# Altium schematic sheet 1N4148W_C7271101_1N4148W_C727110.schdoc
size 127 x 101 mm
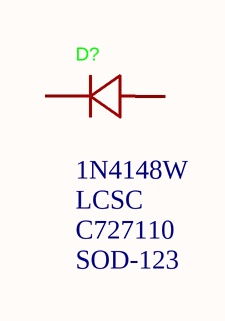
[diagram p0: 1N4148W_C7271101_1N4148W_C727110.schdoc]

## Parts
D?  Supplier Part: C727110  Supplier Footprint: SOD-123  Supplier: LCSC  [SOD-123_L3.1-W1.7-LS3.7-RD]  (hidden comment: 1N4148W)

## Nets

Not connected (* = marked no-connect by the designer): D? 1(K) 2(A)

## Library data of the parts
D? = 1N4148W_C727110: Manufacturer: TWGMC(台湾迪嘉); Current - Rectified: 300mA; Pd - Power Dissipation: 400mW; Reverse Leakage Current (Ir): 1uA; Non-Repetitive Peak Forward Surge Current: 4A; Add into BOM: yes; Diode Configuration: Independent; Voltage - DC Reverse(Vr): 100V; Reverse Recovery Time (trr): 8ns; Operating Junction Temperature Range: -55℃~+150℃@(Tj); Symbol: 1N4148W_C727110; Device: 1N4148W_C727110; Manufacturer Part: 1N4148W; LCSC Part Name: 1N4148W; JLCPCB Part Class: Extended Part; Datasheet: https://item.szlcsc.com/datasheet/1N4148W/774215.html; Convert to PCB: yes; Voltage - Forward(Vf@If): -